# EAGLE board CrowPanel Pico Display-2.8_V1.0_240412 (EAGLE 9.6.2)
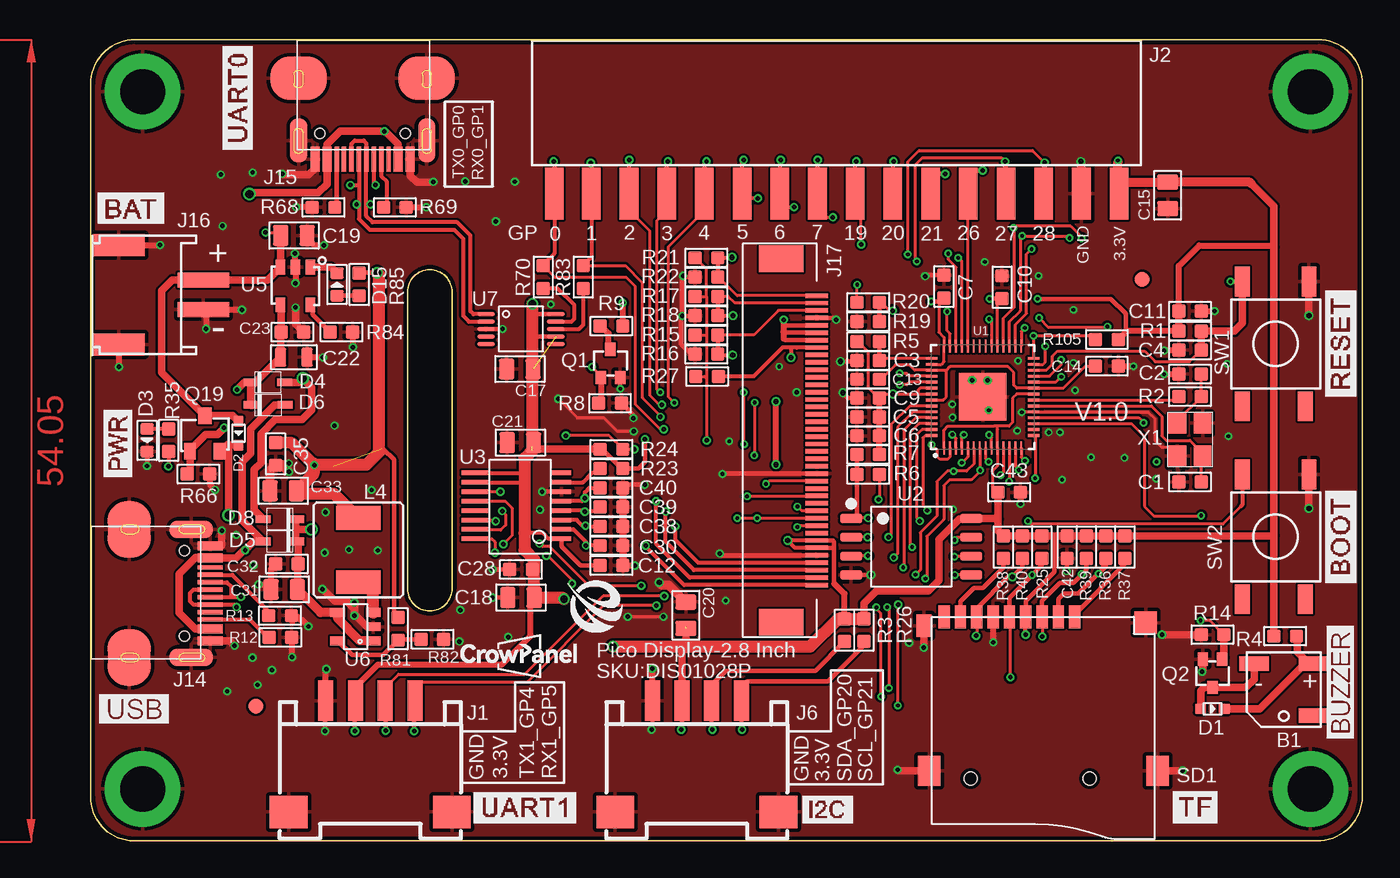
[diagram p5: board, top side]
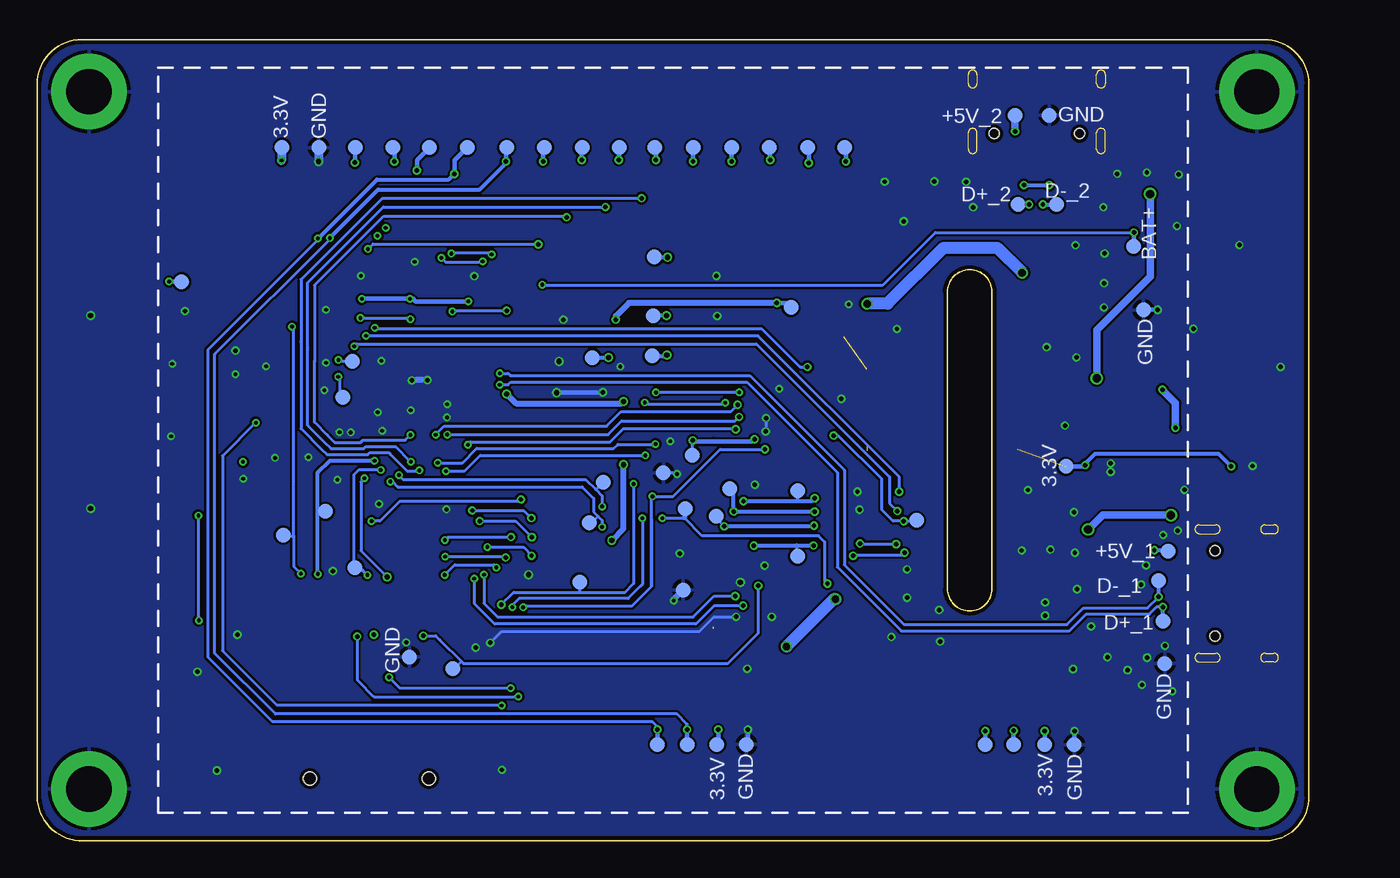
[diagram p6: board, bottom side, seen from below]

Size 85.7 x 54 mm. Coordinates in mm from the lower left corner, seen from the top.
Outline: 2.9,0 82.6,0 arc90 85.7,3 85.7,51 arc90 82.7,54 3,54 arc90 0,51 0,3 arc90 2.9,0
Outline: 21.35,37 21.35,17 arc180 24.35,17 24.35,37 arc180 21.35,37
Copper layers (1*16): Top 0.035mm / dielectric 1.5mm / Bottom 0.035mm
Design rules "default *": minimum track width 0.2mm, minimum drill 0.3mm, track to track 6mil, track to pad 6mil, pad to pad 6mil, via to via 6mil, smd to smd 6mil, copper to edge 10mil, drill to drill 6mil, minimum pad ring 5mil, minimum via ring 5mil, stop-mask expansion 4mil, vias tented up to drill 100mil, thermal gap 10mil
Net classes: 1 PWR: width 0.254 mm; 2 GND: width 0.203 mm; 3 RS485: width 0.203 mm, clearance 0.203 mm; 4 USB: width 0.203 mm, clearance 0.152 mm; 5 ANT: width 0.889 mm, clearance 0.203 mm

## Footprints (pad centres in the part's own frame; a part is rotated, then mirrored left to right if it is on the bottom)
BEEP_5025 = smd 2 x 1: 1 -2,-1.75; 2 2,-1.75; 3 -2,1.75
A_XBJ_0603 = smd 0.889 x 0.889: 1 -0.762,0; 2 0.762,0
A_XBJ_0805 = smd 1.016 x 1.397: 1 -0.889,0; 2 0.889,0
0805_S = smd 0.762 x 1.27: 1 -0.889,0; 2 0.889,0
C0603 = smd 0.889 x 0.889: 1 -0.762,0; 2 0.762,0
DISCRETE_C0603 = smd 0.889 x 0.889: 1 -0.762,0; 2 0.762,0
0603 = smd 0.889 x 0.889: 1 -0.762,0; 2 0.762,0
SOD-523 = smd 0.762 x 0.7: + -0.8,0; - 0.8,0
DISCRETE_D0603 = smd 0.762 x 0.889: + -0.762,0; - 0.762,0
SOD-323 = smd 1.016 x 0.508: 1 1.137,0; 2 -1.137,0
CONNECTOR_4P-SMD-2.0-90D = smd 1.01 x 2.74: 1 -3,-0.1; 2 -1,-0.1; 3 1,-0.1; 4 3,-0.1 | smd 2.54 x 2.184: SS1 -5.5,7.4; SS2 5.5,7.4
2.54-16P-WOTIE = smd 1.25 x 3.5: 1 -18.999,-5.572; 2 -16.51,-5.572; 3 -13.97,-5.572; 4 -11.43,-5.572; 5 -8.89,-5.572; 6 -6.35,-5.572; 7 -3.81,-5.572; 8 -1.27,-5.572; 9 1.27,-5.572; 10 3.81,-5.572; 11 6.35,-5.572; 12 8.89,-5.572; 13 11.43,-5.572; 14 13.97,-5.572; 15 16.51,-5.572; 16 19.05,-5.572
KEVIN_3.0TYPEC-SMD = smd 0.3 x 1.7: A1 -3.35,0.5; A4 -2.55,0.5; A5 -1.25,0.5; A6 -0.25,0.5; A7 0.25,0.5; A8 1.25,0.5; A9 2.55,0.5; A12 3.35,0.5; B1 3.05,0.5; B4 2.25,0.5; B5 1.75,0.5; B6 0.75,0.5; B7 -0.75,0.5; B8 -1.75,0.5; B9 -2.25,0.5; B12 -3.05,0.5 | smd 1.143 x 2.921: P$6 -4.318,-0.762; P$7 4.318,-0.762 | smd 3.81 x 2.921: P$8 -4.318,-4.953; P$9 4.318,-4.953 | hole 0.68: -2.89,-1.22; 2.89,-1.22
PH2.0WT-2PIN = smd 1 x 3.5: P$1 -1,0; P$2 1,0 | smd 1.5 x 3.5: P$3 -3.35,-5.7; P$4 3.35,-5.7
40PIN-0.5MM = smd 0.3 x 1.5: 1 9.42,1.73; 2 8.92,1.73; 3 8.42,1.73; 4 7.92,1.73; 5 7.42,1.73; 6 6.92,1.73; 7 6.42,1.73; 8 5.92,1.73; 9 5.42,1.73; 10 4.92,1.73; 11 4.42,1.73; 12 3.92,1.73; 13 3.42,1.73; 14 2.92,1.73; 15 2.42,1.73; 16 1.92,1.73; 17 1.42,1.73; 18 0.92,1.73; 19 0.42,1.73; 20 -0.08,1.73; 21 -0.58,1.73; 22 -1.08,1.73; 23 -1.58,1.73; 24 -2.08,1.73; 25 -2.58,1.73; 26 -3.08,1.73; 27 -3.58,1.73; 28 -4.08,1.73; 29 -4.58,1.73; 30 -5.08,1.73; 31 -5.58,1.73; 32 -6.08,1.73; 33 -6.58,1.73; 34 -7.08,1.73; 35 -7.58,1.73; 36 -8.08,1.73; 37 -8.58,1.73; 38 -9.08,1.73; 39 -9.58,1.73; 40 -10.08,1.73 | smd 1.8 x 3: P$41 -12.58,-0.67; P$42 11.92,-0.67
CD54_CD54 = smd 3 x 1.6: 1 0,2.159; 2 0,-2.159
CROWPI_POW_PAD-1.0MM = smd 1 x 1: P$1 0,0
PAD-1.0MM = smd 1 x 1: P$1 0,0
SOT-323_W = smd 0.7 x 0.9: 1 -0.65,-0.95; 2 0.65,-0.95; 3 0,0.95
SOT-23 = smd 1.1 x 0.8: 1 1.2,-1; 2 1.2,1 | smd 1.1 x 0.9: 3 -1.2,0
DISCRETE_R0603 = smd 0.889 x 0.889: 1 -0.762,0; 2 0.762,0
9P-SMD-W/-RING = smd 1.524 x 0.762: 1 0,4.4; 2 0,3.3; 3 0,2.2; 4 0,1.1; 5 0,0; 6 0,-1.1; 7 0,-2.2; 8 0,-3.3; 9 0,-4.4 | smd 1.524 x 1.016: G1 0.6,-5.746 | smd 2.032 x 1.524: G2 10.373,-5.4; G3 10.373,10 | smd 1.524 x 1.524: G4 0.392,9.181 | hole 0.889: 10.9,-2.6; 10.9,5.4
KEY-6 = smd 2 x 1: 1 -4.2,2.25; 2 -4.2,-2.25; 3 4.2,-2.25; 4 4.2,2
3M-5 = drill 3.048 pad 5.08: 1 0,0
RP2040_QFN-56 = smd 0.875 x 0.2: 1 -3.437,2.6; 2 -3.437,2.2; 3 -3.437,1.8; 4 -3.437,1.4; 5 -3.437,1; 6 -3.437,0.6; 7 -3.437,0.2; 8 -3.437,-0.2; 9 -3.437,-0.6; 10 -3.437,-1; 11 -3.437,-1.4; 12 -3.437,-1.8; 13 -3.437,-2.2; 14 -3.437,-2.6; 29 3.437,-2.6; 30 3.437,-2.2; 31 3.437,-1.8; 32 3.437,-1.4; 33 3.437,-1; 34 3.437,-0.6; 35 3.437,-0.2; 36 3.437,0.2; 37 3.437,0.6; 38 3.437,1; 39 3.437,1.4; 40 3.437,1.8; 41 3.437,2.2; 42 3.437,2.6 | smd 0.2 x 0.875: 15 -2.6,-3.437; 16 -2.2,-3.437; 17 -1.8,-3.437; 18 -1.4,-3.437; 19 -1,-3.437; 20 -0.6,-3.437; 21 -0.2,-3.437; 22 0.2,-3.437; 23 0.6,-3.437; 24 1,-3.437; 25 1.4,-3.437; 26 1.8,-3.437; 27 2.2,-3.437; 28 2.6,-3.437; 43 2.6,3.437; 44 2.2,3.437; 45 1.8,3.437; 46 1.4,3.437; 47 1,3.437; 48 0.6,3.437; 49 0.2,3.437; 50 -0.2,3.437; 51 -0.6,3.437; 52 -1,3.437; 53 -1.4,3.437; 54 -1.8,3.437; 55 -2.2,3.437; 56 -2.6,3.437 | smd 3.2 x 3.2: EPAD 0,0
SELF_SOIC-8-208MIL = smd 1.5 x 0.635: 1 -4.05,1.905; 2 -4.05,0.635; 3 -4.05,-0.635; 4 -4.05,-1.905; 5 4.05,-1.905; 6 4.05,-0.635; 7 4.05,0.635; 8 4.05,1.905
XP2046-SSOP16 = smd 0.305 x 1.27: 1 -2.54,-2.54; 2 -1.905,-2.54; 3 -1.27,-2.54; 4 -0.635,-2.54; 5 0,-2.54; 6 0.635,-2.54; 7 1.27,-2.54; 8 1.905,-2.54 | smd 0.305 x 1.778: 9 1.905,3.302; 10 1.27,3.302; 11 0.635,3.302; 12 0,3.302; 13 -0.635,3.302; 14 -1.27,3.302; 15 -1.905,3.302; 16 -2.54,3.302
SOP23-5 = smd 1 x 0.635: 1 -1.27,1; 2 -1.27,0; 3 -1.27,-1; 4 1.27,-1; 5 1.27,1
CROWBOT_-V1.0-20220525_A_XBJ_SOT23-5 = smd 0.6 x 1: 1 -0.95,-1.2; 2 0,-1.2; 3 0.95,-1.2; 4 0.95,1.2; 5 -0.95,1.2
MSOP-10_W = smd 1.2 x 0.3: 1 -2.35,1; 2 -2.35,0.5; 3 -2.35,0; 4 -2.35,-0.5; 5 -2.35,-1; 6 2.35,-1; 7 2.35,-0.5; 8 2.35,0; 9 2.35,0.5; 10 2.35,1
A_XBJ_SMD3225 = smd 1.4 x 1.2: 1 -1.1,-0.85; 2 1.1,-0.85; 3 1.1,0.85; 4 -1.1,0.85

## Placement (x,y rotation side)
B1  BEEP_5025  [BEEP_5025]  80.4,10.2 180 top
C1  12PF  [A_XBJ_0603]  74.08,24.2 180 top
C2  12PF  [A_XBJ_0603]  74.08,31.46 0 top
C3  2.2UF  [A_XBJ_0603]  52.4,32.38 180 top
C4  100NF  [A_XBJ_0603]  74.08,33.08 180 top
C5  100NF  [A_XBJ_0603]  52.4,28.58 180 top
C6  2.2UF  [A_XBJ_0603]  52.4,27.31 180 top
C7  100NF  [A_XBJ_0603]  57.5,37.36 90 top
C9  100NF  [A_XBJ_0603]  52.4,29.86 180 top
C10  100NF  [A_XBJ_0603]  61.42,37.32 90 top
C11  100NF  [A_XBJ_0603]  74.08,35.7 0 top
C12  100NF  [A_XBJ_0603]  35.1,18.56 0 top
C13  100NF  [A_XBJ_0603]  52.4,31.11 180 top
C14  100NF  [A_XBJ_0603]  68.48,32 0 top
C15  47UF  [A_XBJ_0805]  72.57,43.51 90 top
C17  47UF  [A_XBJ_0805]  28.93,31.8 180 top
C18  22UF  [A_XBJ_0805]  29,16.4 0 top
C19  22UF  [A_XBJ_0805]  13.7,40.8 180 top
C20  47UF  [A_XBJ_0805]  40.11,15.21 90 top
C21  47UF  [A_XBJ_0805]  28.96,26.85 180 top
C22  22uF  [0805_S]  13.69,32.6 180 top
C23  100nF  [C0603]  13.59,34.3 0 top
C28  1uF  [DISCRETE_C0603]  29,18.3 0 top
C30  100pF  [0603]  35.1,19.9 180 top
C31  22UF  [A_XBJ_0805]  13.04,16.95 0 top
C32  100nF  [A_XBJ_0603]  13.23,18.66 180 top
C33  22UF  [A_XBJ_0805]  12.98,23.59 0 top
C35  100NF  [A_XBJ_0603]  12.47,26.08 270 top
C38  100pF  [0603]  35.1,21.2 180 top
C39  100pF  [0603]  35.1,22.5 180 top
C40  100pF  [0603]  35.1,23.8 180 top
C42  1uF  [DISCRETE_C0603]  65.8,19.8 90 top
C43  100nF  [C0603]  61.9,23.5 0 top
D1  B5819WT  [SOD-523]  75.6,8.9 0 top
D2  B5819WT  [SOD-523]  9.96,27.47 270 top
D3  [DISCRETE_D0603]  3.8,27 270 top
D4  SOD-323  [SOD-323]  11.94,30.91 0 top
D5  SOD-323  [SOD-323]  12.76,20.18 180 top
D6  SOD-323  [SOD-323]  11.96,29.39 0 top
D8  SOD-323  [SOD-323]  12.76,21.69 180 top
D15  NC  [DISCRETE_D0603]  16.6,37.5 90 top
J1  [CONNECTOR_4P-SMD-2.0-90D]  18.85,9.35 180 top
J2  2.54-16PIN-WOTIE  [2.54-16P-WOTIE]  50.25,49.2 0 top
J6  [CONNECTOR_4P-SMD-2.0-90D]  40.85,9.35 180 top
J14  USB_TYPE-C_16PIN3.0USB  [KEVIN_3.0TYPEC-SMD]  7.55,16.68 270 top
J15  USB_TYPE-C_16PIN3.0USB  [KEVIN_3.0TYPEC-SMD]  18.33,46.45 180 top
J16  PH2.0WT-2PIN  [PH2.0WT-2PIN]  7.6,36.8 270 top
J17  LXGD-28A1044-E-T2  [40PIN-0.5MM]  47.2,26.67 270 top
L4  5.6uH-0530  [CD54_CD54]  18.04,19.6 180 top
P1  CROWPI_POW_PADPAD-1.0MM  [CROWPI_POW_PAD-1.0MM]  9.71,11.95 0 bottom
P2  CROWPI_POW_PADPAD-1.0MM  [CROWPI_POW_PAD-1.0MM]  9.47,19.52 0 bottom
P3  CROWPI_POW_PADPAD-1.0MM  [CROWPI_POW_PAD-1.0MM]  9.83,14.8 0 bottom
P4  CROWPI_POW_PADPAD-1.0MM  [CROWPI_POW_PAD-1.0MM]  10.14,17.55 0 bottom
P5  CROWPI_POW_PADPAD-1.0MM  [CROWPI_POW_PAD-1.0MM]  49.14,17.44 0 bottom
P6  CROWPI_POW_PADPAD-1.0MM  [CROWPI_POW_PAD-1.0MM]  11.14,35.79 0 bottom
P7  CROWPI_POW_PADPAD-1.0MM  [CROWPI_POW_PAD-1.0MM]  11.81,40.06 0 bottom
P8  CROWPI_POW_PADPAD-1.0MM  [CROWPI_POW_PAD-1.0MM]  31.28,46.73 0 bottom
P9  CROWPI_POW_PADPAD-1.0MM  [CROWPI_POW_PAD-1.0MM]  60.6,12.39 0 bottom
P10  CROWPI_POW_PADPAD-1.0MM  [CROWPI_POW_PAD-1.0MM]  17.8,6.5 0 bottom
P11  CROWPI_POW_PADPAD-1.0MM  [CROWPI_POW_PAD-1.0MM]  65.1,29.9 0 bottom
P12  CROWPI_POW_PADPAD-1.0MM  [CROWPI_POW_PAD-1.0MM]  64.46,32.33 0 bottom
P13  CROWPI_POW_PADPAD-1.0MM  [CROWPI_POW_PAD-1.0MM]  41.55,26.01 0 bottom
P14  CROWPI_POW_PADPAD-1.0MM  [CROWPI_POW_PAD-1.0MM]  15.81,6.48 0 bottom
P15  CROWPI_POW_PADPAD-1.0MM  [CROWPI_POW_PAD-1.0MM]  41.9,6.5 0 bottom
P16  CROWPI_POW_PADPAD-1.0MM  [CROWPI_POW_PAD-1.0MM]  43.9,6.5 0 bottom
P17  CROWPI_POW_PADPAD-1.0MM  [CROWPI_POW_PAD-1.0MM]  33.78,46.73 0 bottom
P18  CROWPI_POW_PADPAD-1.0MM  [CROWPI_POW_PAD-1.0MM]  36.38,46.73 0 bottom
P19  CROWPI_POW_PADPAD-1.0MM  [CROWPI_POW_PAD-1.0MM]  38.88,46.73 0 bottom
P20  CROWPI_POW_PADPAD-1.0MM  [CROWPI_POW_PAD-1.0MM]  41.47,46.73 0 bottom
P21  CROWPI_POW_PADPAD-1.0MM  [CROWPI_POW_PAD-1.0MM]  37.9,6.5 0 bottom
P22  CROWPI_POW_PADPAD-1.0MM  [CROWPI_POW_PAD-1.0MM]  39.9,6.5 0 bottom
P23  CROWPI_POW_PADPAD-1.0MM  [CROWPI_POW_PAD-1.0MM]  19.9,6.5 0 bottom
P24  CROWPI_POW_PADPAD-1.0MM  [CROWPI_POW_PAD-1.0MM]  21.8,6.5 0 bottom
P25  CROWPI_POW_PADPAD-1.0MM  [CROWPI_POW_PAD-1.0MM]  17.5,48.9 0 bottom
P26  CROWPI_POW_PADPAD-1.0MM  [CROWPI_POW_PAD-1.0MM]  19.8,48.9 0 bottom
P27  CROWPI_POW_PADPAD-1.0MM  [CROWPI_POW_PAD-1.0MM]  19.6,42.9 0 bottom
P28  CROWPI_POW_PADPAD-1.0MM  [CROWPI_POW_PAD-1.0MM]  17,42.9 0 bottom
P29  CROWPI_POW_PADPAD-1.0MM  [CROWPI_POW_PAD-1.0MM]  42.16,16.91 0 bottom
P30  CROWPI_POW_PADPAD-1.0MM  [CROWPI_POW_PAD-1.0MM]  69.2,46.74 0 bottom
P31  CROWPI_POW_PADPAD-1.0MM  [CROWPI_POW_PAD-1.0MM]  75.96,37.68 0 bottom
P32  CROWPI_POW_PADPAD-1.0MM  [CROWPI_POW_PAD-1.0MM]  42.02,22.4 0 bottom
P33  CROWPI_POW_PADPAD-1.0MM  [CROWPI_POW_PAD-1.0MM]  34.46,19.18 0 bottom
P34  CROWPI_POW_PADPAD-1.0MM  [CROWPI_POW_PAD-1.0MM]  47.54,24.19 0 bottom
P35  CROWPI_POW_PADPAD-1.0MM  [CROWPI_POW_PAD-1.0MM]  48.49,21.44 0 bottom
P36  CROWPI_POW_PADPAD-1.0MM  [CROWPI_POW_PAD-1.0MM]  66.26,22.21 0 bottom
P37  CROWPI_POW_PADPAD-1.0MM  [CROWPI_POW_PAD-1.0MM]  34.46,23.59 0 bottom
P38  CROWPI_POW_PADPAD-1.0MM  [CROWPI_POW_PAD-1.0MM]  39.04,23.74 0 bottom
P39  CROWPI_POW_PADPAD-1.0MM  [CROWPI_POW_PAD-1.0MM]  39.95,21.89 0 bottom
P41  CROWPI_POW_PADPAD-1.0MM  [CROWPI_POW_PAD-1.0MM]  34.89,35.95 0 bottom
P42  CROWPI_POW_PADPAD-1.0MM  [CROWPI_POW_PAD-1.0MM]  43.5,24.8 0 bottom
P43  CROWPI_POW_PADPAD-1.0MM  [CROWPI_POW_PAD-1.0MM]  16.37,25.25 0 bottom
P44  CROWPI_POW_PADPAD-1.0MM  [CROWPI_POW_PAD-1.0MM]  26.44,21.6 0 bottom
P45  CROWPI_POW_PADPAD-1.0MM  [CROWPI_POW_PAD-1.0MM]  64.28,18.43 0 bottom
P46  CROWPI_POW_PADPAD-1.0MM  [CROWPI_POW_PAD-1.0MM]  57.7,11.6 0 bottom
P47  CROWPI_POW_PADPAD-1.0MM  [CROWPI_POW_PAD-1.0MM]  69.11,20.61 0 bottom
P48  PADPAD-1.0MM  [PAD-1.0MM]  11.14,9.08 0 top
P49  PADPAD-1.0MM  [PAD-1.0MM]  70.86,37.85 0 top
P50  CROWPI_POW_PADPAD-1.0MM  [CROWPI_POW_PAD-1.0MM]  44.07,46.73 0 bottom
P51  CROWPI_POW_PADPAD-1.0MM  [CROWPI_POW_PAD-1.0MM]  46.47,46.73 0 bottom
P52  CROWPI_POW_PADPAD-1.0MM  [CROWPI_POW_PAD-1.0MM]  48.97,46.73 0 bottom
P53  CROWPI_POW_PADPAD-1.0MM  [CROWPI_POW_PAD-1.0MM]  51.52,46.73 0 bottom
P54  CROWPI_POW_PADPAD-1.0MM  [CROWPI_POW_PAD-1.0MM]  54.06,46.73 0 bottom
P55  CROWPI_POW_PADPAD-1.0MM  [CROWPI_POW_PAD-1.0MM]  56.72,46.73 0 bottom
P56  CROWPI_POW_PADPAD-1.0MM  [CROWPI_POW_PAD-1.0MM]  59.26,46.73 0 bottom
P57  CROWPI_POW_PADPAD-1.0MM  [CROWPI_POW_PAD-1.0MM]  61.72,46.73 0 bottom
P58  CROWPI_POW_PADPAD-1.0MM  [CROWPI_POW_PAD-1.0MM]  64.26,46.73 0 bottom
P59  CROWPI_POW_PADPAD-1.0MM  [CROWPI_POW_PAD-1.0MM]  66.72,46.73 0 bottom
P60  CROWPI_POW_PADPAD-1.0MM  [CROWPI_POW_PAD-1.0MM]  44.25,32.69 0 bottom
P61  CROWPI_POW_PADPAD-1.0MM  [CROWPI_POW_PAD-1.0MM]  44.18,35.39 0 bottom
P62  CROWPI_POW_PADPAD-1.0MM  [CROWPI_POW_PAD-1.0MM]  44.1,39.36 0 bottom
P63  CROWPI_POW_PADPAD-1.0MM  [CROWPI_POW_PAD-1.0MM]  48.28,32.58 0 bottom
Q1  HXY2102EI  [SOT-323_W]  35.03,32.18 0 top
Q2  HXY2102EI  [SOT-323_W]  75.6,11.3 180 top
Q19  PMOS-3401-4A  [SOT-23]  7.69,27.46 270 top
R1  10K  [DISCRETE_R0603]  74.08,34.36 180 top
R2  1K  [DISCRETE_R0603]  74.08,29.94 180 top
R3  4.7K  [DISCRETE_R0603]  50.8,14.2 90 top
R4  3R  [DISCRETE_R0603]  80.5,13.8 180 top
R5  0R  [DISCRETE_R0603]  52.4,33.66 180 top
R6  1K  [DISCRETE_R0603]  52.4,24.7 0 top
R7  10K  [DISCRETE_R0603]  52.4,26.05 0 top
R8  10K/NC  [DISCRETE_R0603]  35,29.5 180 top
R9  0R 5%  [DISCRETE_R0603]  35.1,34.7 0 top
R12  5.1K  [DISCRETE_R0603]  12.79,13.73 0 top
R13  5.1K  [DISCRETE_R0603]  12.76,15.18 180 top
R14  10K/NC  [DISCRETE_R0603]  75.6,13.9 0 top
R15  NC  [DISCRETE_R0603]  41.5,34.1 180 top
R16  0R  [DISCRETE_R0603]  41.5,32.8 0 top
R17  10K  [DISCRETE_R0603]  41.5,36.7 180 top
R18  NC  [DISCRETE_R0603]  41.5,35.4 0 top
R19  100K1%  [DISCRETE_R0603]  52.4,35 180 top
R20  100K1%  [DISCRETE_R0603]  52.4,36.3 0 top
R21  10K  [DISCRETE_R0603]  41.5,39.3 180 top
R22  NC  [DISCRETE_R0603]  41.5,38 0 top
R23  10K/NC  [DISCRETE_R0603]  35.1,25.1 180 top
R24  1K  [DISCRETE_R0603]  35.1,26.4 180 top
R25  1K  [DISCRETE_R0603]  64.1,19.8 90 top
R26  4.7K  [DISCRETE_R0603]  52.1,14.2 90 top
R27  3R  [DISCRETE_R0603]  41.54,31.3 180 top
R35  4.7K  [DISCRETE_R0603]  5.25,27 270 top
R36  10K  [DISCRETE_R0603]  68.4,19.8 270 top
R37  10K  [DISCRETE_R0603]  69.7,19.8 270 top
R38  10K  [DISCRETE_R0603]  61.5,19.8 270 top
R39  10K  [DISCRETE_R0603]  67.1,19.8 270 top
R40  10K  [DISCRETE_R0603]  62.8,19.8 270 top
R66  10K  [DISCRETE_R0603]  7.26,24.72 180 top
R68  5.1K  [DISCRETE_R0603]  15.7,42.7 180 top
R69  5.1K  [DISCRETE_R0603]  20.5,42.7 180 top
R70  0R  [DISCRETE_R0603]  30.5,38 90 top
R81  45.3K 1%  [DISCRETE_R0603]  20.71,14.29 270 top
R82  10K 1%  [DISCRETE_R0603]  23.03,13.59 180 top
R83  0R  [DISCRETE_R0603]  33.2,38 90 top
R84  2K  [DISCRETE_R0603]  16.9,34.3 0 top
R85  4.7K  [DISCRETE_R0603]  18.1,37.5 90 top
R105  10K  [DISCRETE_R0603]  68.48,33.8 0 top
SD1  [9P-SMD-W/-RING]  61.91,15.1 270 top
SW1  KEY-6  [KEY-6]  79.85,33.5 270 top
SW2  KEY-6  [KEY-6]  79.85,20.5 270 top
T1  3M-5  [3M-5]  3.5,50.5 0 top
T2  3M-5  [3M-5]  3.5,3.5 0 top
T3  3M-5  [3M-5]  82.2,3.5 0 top
T4  3M-5  [3M-5]  82.2,50.5 0 top
U1  RP2040_RP2040  [RP2040_QFN-56]  60.11,29.92 90 top
U2  SELF_W25Q128JV  [SELF_SOIC-8-208MIL]  55.3,19.83 0 top
U3  XPT2046  [XP2046-SSOP16]  29.2,22.9 90 top
U5  4054A  [SOP23-5]  13.8,37.4 270 top
U6  HM3416H  [CROWBOT_-V1.0-20220525_A_XBJ_SOT23-5]  17.85,14.44 90 top
U7  CH340X  [MSOP-10_W]  29,34.5 0 top
X1  12MHZ_SMD3225  [A_XBJ_SMD3225]  74.08,27.05 90 top

## Tracks (layer width: path | path; a pad name or v marks a point on that pad's centre or on a via)
+1V1
  Top 0.2: 54.22,32.08 53.25,31.11 C13.1 | U1.50 57.46,29.72 57.66,29.92 57.66,31.7 | U1.23 62.41,30.52 62.21,30.72 62.21,31.56 61.81,31.95 57.91,31.95 57.66,31.7 | 57.66,31.7 57.64,31.72 U1.45
  Top 0.203: U1.45 55.52,31.72 55.16,32.08 54.22,32.08 | U1.23 65.55,30.52 67.03,32 C14.1
+3V3  (via drill 0.25, 0.3, 0.35, 0.5)  (4 unrouted)
  Top 0.2: U1.44 57.32,32.12 57.51,32.31 U1.42 | 58.97,21.69 59.3,21.69 U2.8 | U1.1 57.51,27.71 57.75,27.95 60.87,27.95 60.9,27.95 | U1.10 61.11,27.74
  Top 0.203: 53.3,29.86 C9.1 | 69.22,45.76 v69.22,45.86 | R7.2 53.31,26.05 | C9.1 53.42,30.12 v54.06,30.12 55.78,30.12 | 55.78,30.12 U1.49 | 55.78,30.12 55.78,30.41 55.89,30.52 U1.48 | R21.2 41.49,38.55 41.49,36.69 | R17.2 41.48,36.7 41.49,36.69 | U1.33 61.11,36.25 C10.1 | U1.42 57.51,33.94 57.16,34.29 57.16,36.36 57.16,36.9 57.46,36.6 C7.1 | U1.22 62.41,30.12 62.13,29.84 62.13,28.2 61.88,27.95 61.11,27.95 | 61.11,27.95 60.87,27.95 | 61.11,27.74 61.11,27.95 | U1.10 61.11,25.28 60.75,24.92 60.75,23.89 C43.1 | C9.1 53.07,29.86 52.41,30.53 52.41,32.95 51.7,33.66 | v41.52,26.99 41.49,27.02 41.49,31.15 | 41.49,36.69 41.49,34.08 | 41.49,34.08 41.49,31.15 | R15.2 41.47,34.1 41.49,34.08 | 69.8,34.36 R105.2 | J2.16 69.3,43.95 69.66,44.31 | R27.2 41.34,31.3 41.49,31.15
  Top 0.254: v63,13.9 SD1.4 | 61.31,20.37 R38.1 | R35.2 5.25,25.24 v5.23,25.24 | 15.03,25.45 13.63,26.84 C35.1 13.39,26.84 14.87,25.33 v15.07,25.33 | J17.7 v46.98,20.25 | v46.98,20.25 v46.97,20.25 | J17.6 47.48,19.75 v46.98,20.25 | U3.9 29.22,24.8 29.23,24.82 | U3.10 29.18,24.17 29.23,24.12 | U3.1 30.86,20.36 30.48,20.74 29.23,20.74
  Top 0.3: J6.3 39.85,7.55 v39.8,7.5
  Top 0.305: 64.1,20.46 R25.2 | 73.31,35.69 C11.1 | C12.1 33.01,18.56 31.74,19.83 U3.1 | U7.7 29.76,34 29.76,35.53 | 51.7,33.66 R5.2 | R24.2 34.46,26.4 35.76,25.1 R23.1 36.91,25.1 37.35,25.54 v37.35,27.07 | v41.52,26.99 41.59,26.92 | R85.2 18.13,38.29 v19.31,38.29 | v29.77,36.2 v29.76,36.19 29.76,35.53 | U7.10 29.79,35.5 29.76,35.53 | v17.8,7.4 17.8,9.4 J1.3 | SD1.4 63.01,16.19 64.95,18.13 64.95,20.5 64.89,20.56 | J17.7 50.01,20.25 50.1,20.16 50.1,19.75 | 50.1,17.35 50.1,19.75 | J17.6 50.1,19.75 | C10.1 60.61,36.56 v60.59,36.54 | v63.82,36.53 68.76,36.53 69.75,35.54 69.75,34.31 | v56.65,36.36 57.16,36.36 | R81.1 20.44,15.32 20.44,25.69 19.72,26.41 19.64,26.41 | 29.88,16.17 29.66,16.17
  Top 0.406: 53.3,29.86 53.16,29.72 C5.1 C6.1 R7.2 | R105.2 69.75,34.31 | R1.2 69.8,34.36 | R3.2 50.8,16.65 50.1,17.35 | C11.1 73.32,38.75 74.7,40.13 79.64,40.13 79.74,40.03 | J1.3 17.85,10.37 19.37,11.89 27.72,11.89 29.66,13.82 29.66,16.17 29.75,16.26 | v46.18,25.36 v46.18,29.61
  Top 0.508: C18.2 | C18.2 29.75,16.26 | C18.2 29.88,16.17 | 29.89,18.17 C28.2 | 29.76,26.58 29.76,26.4 R24.2 | 40.13,13.07 39.85,12.79 J6.3 | R37.1 69.88,20.74 | R105.2 69.33,33.89 | v31.9,16.3 29.97,16.3 C18.2 | R4.2 79.74,20.56 | R37.1 R36.1 R39.1 C42.2 64.89,20.56 64.2,20.56 64.1,20.46 | R25.2 R40.1 R38.1 61.14,20.92 61.14,21.67 | 61.14,21.67 C43.1 | U2.8 61.07,21.73 61.14,21.67 | R1.2 73.32,35.68 73.31,35.69 | R26.2 52.1,15.99 52.95,16.84 56.45,16.84 57.15,17.54 57.15,20.31 58.53,21.69 58.97,21.69 | 40.13,13.07 40.13,14.41 | 40.13,13.07 48.46,13.07 50.35,14.96 R3.2 | R37.1 79.74,20.56 | 79.74,20.56 79.74,40.03 79.74,42.78 78.21,44.31 | 69.66,44.31 69.59,44.38
  Top 0.61: 69.22,45.76 69.22,43.71 J2.16 69.3,44.32 69.38,44.4 C15.2 78.12,44.4 78.21,44.31
  Top 0.813: L4.2 16.41,23.39 14.07,23.39 C33.2 15.03,24.75 15.03,25.45 | C35.1 13.57,26.81 15.02,25.37 15.15,25.37 18.59,25.37 19.45,26.22 19.45,38.16 v19.31,38.29 | v29.77,36.2 29.77,26.81 29.81,26.81 C21.1 29.76,26.76 29.76,26.4 | v31.9,16.3 31.8,16.4 C18.2 29.89,18.17 29.89,18.95 29.23,19.6 29.23,20.74 29.23,24.12 29.23,24.82 29.23,25.78 29.76,26.31 | v35.2,13.1 40.1,13.1 | 40.1,13.1 40.13,13.07 | 40.1,13.1 48.49,13.1 50.35,14.96 | 52.11,14.96 R26.2 R3.2 | 29.76,31.75 C17.1
  Bottom 0.203: P13.P$1 41.55,26.92 40.1,26.92
  Bottom 0.254: v5.23,25.24 6.08,26.09 14.41,26.09 15.25,25.25 P43.P$1
  Bottom 0.3: v39.8,7.5 39.8,6.6 P22.P$1
  Bottom 0.305: v37.35,27.07 37.5,26.92 40.1,26.92 41.45,26.92 v41.52,26.99 | P10.P$1 v17.8,7.4 | P43.P$1 15.15,25.25 v15.07,25.33 | v63.82,36.53 v63.81,36.54 v60.59,36.54 60.37,36.54 60.19,36.36 v56.65,36.36
  Bottom 0.406: v46.97,20.25 46.18,21.05 v46.18,25.36 | v46.18,29.61 46.31,29.48 53.41,29.48 54.06,30.13 v54.06,30.12
  Bottom 0.61: P30.P$1 69.22,46.72 v69.22,45.86
  Bottom 0.813: v19.31,38.29 20.99,39.97 24.62,39.97 28.39,36.2 v29.77,36.2 | v31.9,16.3 32,16.3 v35.2,13.1
+5V_UART0  (via drill 0.3, 0.55)
  Top 0.254: 20.73,46.1 J15.A4 J15.B9 | J15.B4 J15.A9 | J15.B4 15.92,45.79 | J15.B4 15.93,46.1 15.93,46.48
  Top 0.508: 20.73,46.1 20.73,46.95 19.86,47.83 v19.79,47.83 16.81,47.83 15.93,46.94 15.93,46.48 15.93,45.95 | 15.92,45.79 15.92,44.27 15.34,43.69 10.79,43.69 v10.7,43.6 | D4.1 14.02,30.91 v14.3,31.18 14.9,30.57 14.9,29.05 14.24,28.39 12.44,28.39 11.48,27.42 11.48,25.48 11.02,25.03 11.02,22.27 11.04,22.27 D8.1 11.64,21.67 11.85,21.67
  Bottom 0.508: P26.P$1 v19.8,47.84 v19.79,47.83 | v10.7,43.6 10.69,43.59 10.69,38.02 14.3,34.41 v14.3,31.18
+5V_USB  (via drill 0.3)
  Top 0.254: 8.21,19.07 J14.A4 J14.B9 7.91,19.07 7.91,19.09 | 8.05,14.29 J14.B4 J14.A9
  Top 0.508: 8.21,19.07 9.82,19.07 10.38,19.63 v10.41,19.6 11,20.18 D5.1 10.22,21.59 10.22,25.55 10.77,26.1 10.77,27.76 12.4,29.39 D6.1 | 8.05,14.29 7.03,14.29 5.97,15.36 5.97,17.99 7.07,19.09 7.91,19.09
  Bottom 0.254: v10.41,19.6 9.55,19.6 P2.P$1
AVDD
  Top 0.2: U1.43 53.3,32.52 C3.1
  Top 0.203: 53.5,32.52 C3.1
  Top 0.305: C3.1 R5.1
BAT+  (via drill 0.25, 0.3)
  Top 0.203: v11.79,41 12.61,41 C19.2 | R20.1 51.64,37.48 v51.65,37.49
  Top 0.508: C19.2 12.8,40.79 U5.3 11.93,37.8 J16.P$1 5.5,37.8 4.78,37.08 4.78,31.58 Q19.3 9.57,28.66 D2.+
  Bottom 0.203: v11.79,41 v11.8,41.01 25.18,41.01 28.75,37.44 51.6,37.44 v51.65,37.49
  Bottom 0.305: P7.P$1 v11.8,41.01
BOOT  (via drill 0.25, 0.3)
  Top 0.203: 77.6,24.2 77.6,24.6 SW2.2 | R6.2 53.16,23.08 v53.09,23.01 | v63.16,21.56 63.37,21.35 76.31,21.35 77.51,22.55
  Top 0.254: SW2.2 77.6,22.64 77.51,22.55
  Top 0.305: 77.6,24.45 77.6,24.6
  Bottom 0.203: v53.09,23.01 53.21,22.9 61.25,22.9 62.59,21.56 v63.16,21.56
CHG_LED
  Top 0.508: U5.1 16.19,38.67 D15.-
GND  (via drill 0.25, 0.3, 0.35)
  Top 0.203: J14.B12 8.22,19.9 | J14.A12 8.2,13.48 | v38.6,15.1 v36.2,15.1 | v36.6,27.6 35.5,27.6 34.6,28.5 32.8,28.5 v31.5,29.8 | J15.A12 15.15,45.78 | J15.A1 21.53,45.8 | X1.4 72.63,26.55 72.16,26.55 71.71,26.99 71.71,28.46 71.25,28.92 U1.19 62.77,28.92 v62.75,28.9
  Top 0.3: v50.24,35.13 50.12,35.25 J17.37 | J6.4 37.85,7.55 v37.8,7.5
  Top 0.305: U7.3 v27.76,34.5 | C28.1 v27.08,18.3 | C18.1 v27.09,16.4 v27.08,16.39 | U3.6 v30.43,23.54 v30.42,23.53 | J17.5 42.52,19.25 v42.4,19.37 | J17.16 42.6,24.75 v42.58,24.73 | Q1.2 v35.69,30.48 | R8.1 36.58,28.68 v36.58,28.5 | C40.1 36.07,24.01 v37.33,24.01 | v15.8,7.4 15.8,9.4 J1.4 | C42.1 65.8,18.22 v65.77,18.19 | C9.2 51.04,29.86 v50.7,30.21 | U2.4 52.56,17.93 v52.58,17.94 | C3.2 51.58,32.32 v50.53,32.32 | R18.1 40.72,35.38 v39.86,35.38 | R22.1 40.01,38 v39.92,38.09 39.86,38.03 v39.86,35.38 | C7.2 56.3,38.12 v56.24,38.06 | D3.- v3.8,25.28 v3.79,25.27 | R16.1 40.47,32.8 39.78,33.5 39.78,35.3 v39.86,35.38
  Top 0.406: v10.19,35.8 J16.P$2 7.78,35.62 v7.78,34.51 | J16.P$3 v4.67,40.15 v4.68,40.16 | J16.P$4 v1.9,31.95 v1.91,31.94 | R68.2 v13.86,42.7 v13.85,42.71 | C19.1 14.59,40.63 15.07,40.15 v15.73,40.15 | v13.77,39.59 13.77,38.7 U5.2 v13.8,37.59 | R69.1 21.27,42.71 v22.62,42.71 | 51.64,34.8 R19.2 | U2.4 51.31,17.87 | C22.1 15.64,32.6 v15.66,32.58 | R84.2 v17.66,33.29 v17.67,33.28 | C32.2 12.16,18.35 C31.1 11.83,17.28 v11.3,17.28 | R66.1 8.03,24.02 v8.39,23.66 | R13.1 13.32,15.18 13.58,14.92 | 13.58,14.78 13.58,14.92 | v14.68,14.46 14.21,14.93 14.09,14.93 13.61,15.41 13.61,14.89 13.58,14.92 | R12.2 13.55,12.41 v13.57,12.39 | U1.EPAD 60.11,30.36 v59.41,31.06 | C12.2 v36.67,18.56 v36.68,18.55 | SD1.6 60.81,13.4 v60.83,13.38 | J6.4 v37.85,11.6 | J1.4 15.85,11.55 v15.88,11.58 | C14.2 v70.26,32 v70.27,31.99 | C2.1 73.3,31.44 v72.33,31.44 | C4.2 73.28,33.04 v72.34,33.04 | C43.2 v62.66,22.71 | C11.2 v75.73,35.7 v75.74,35.71 | C35.2 13.23,25.32 v13.35,25.45 12.55,25.45 12.09,24.99 C33.1
  Top 0.508: C12.2 C30.1 C38.1 C39.1 C40.1 | 8.22,19.9 8.84,19.9 v8.84,20.92 | 8.2,13.48 9.37,13.48 v9.7,13.15 | C23.2 13.81,34.84 v13.81,35.95 | 15.15,45.78 15.15,45.34 14.7,44.89 12.99,44.89 v12.91,44.97 | 21.53,45.8 21.53,44.85 21.99,44.39 23.05,44.39 v23.09,44.43 | SD1.G1 56.16,13.04 v56.15,13.03 | SD1.G3 71.92,4.74 v73.58,4.74 | SD1.G2 54.43,4.73 v54.37,4.79 | SW1.1 v82.1,35.4 | SW2.1 v82.1,22.4 | 66.76,45.77 v66.74,45.79 | Q2.2 74.95,11.45 v74.9,11.4 | R14.1 v72.2,13.9 | v17.77,15.17 17.89,15.17 18.62,14.44 U6.2 | v15.62,16.97 15.64,16.97 16.45,16.16 17.25,16.16 17.77,15.64 v17.77,15.17 | v17.78,16.07 v17.78,15.18 v17.77,15.17
  Top 0.61: C33.1 12.09,24.99 C35.2 12.91,25.32 v13.36,24.87 | J2.15 66.76,45.77 | v38.32,17.42 38.5,17.23 38.96,17.23 C20.2
  Bottom 0.203: v38.6,15.1 40.07,15.1 41.08,14.09 54.42,14.09 v55.16,13.35 | v36.58,28.5 36.58,27.62 v36.6,27.6 | v42.58,24.73 42.65,24.8 P42.P$1
  Bottom 0.3: v37.8,7.5 37.8,6.6 P21.P$1
  Bottom 0.305: P14.P$1 v15.81,7.39 v15.8,7.4 | v50.7,30.21 47.61,30.21 v47.58,30.24 | v10.19,35.8 P6.P$1
  Bottom 0.406: v59.41,31.06 60.41,31.06 v60.44,31.03 | P29.P$1 42.8,16.27 v42.8,16.2
  Bottom 0.61: P59.P$1 66.74,46.71 v66.74,45.79
  other vias: 60.26,39.03 63.89,38.09 66.23,32.23 66.34,30.38 46.4,31.97 43.04,26.95 31.01,36.17 58.08,28.54 62.51,32.36 66.23,35.79 58.11,22.34 60.53,29.03 62.45,27.65 64.57,27.53 65.32,27.54 65.47,24.34 67.41,25.86 69.66,25.81 71.81,24.41 76.67,27.28 76.59,32.15 58.07,29.42 25.24,44.45 28.58,44.43 10.92,45.04 8.77,44.91 8.89,41.44 27.3,41.76 16.43,27.99 18.93,23.65 15.83,22.16 15.77,19.43 19.34,19.58 17.41,19.64 24.84,13.44 28.13,13.74 24.92,15.56 30.28,22.33 9.81,20.62 12.21,11.51 11.25,10.52 10.9,12.36 9.2,10.08 10.97,18.57
  pour Top: -1,55 -1,-1 86.5,-1 86.5,55
  pour Bottom: -0.5,54.5 -0.5,-0.5 86,-0.5 86,54.5
GND1  (via drill 0.25)
  other vias: 71.83,25.55
GP0/UART0_TX  (via drill 0.25, 0.3)
  Top 0.203: R70.2 31.26,38 36.09,38 36.7,37.39 36.7,29.46 38.42,27.74 v38.62,27.74 | U1.2 57.91,25.88 57.74,25.71 57.24,25.71 57.04,25.91 57.04,26.34 v56.68,26.7
  Top 0.254: R70.2 30.5,38.84 31.25,39.59 J2.1
  Top 0.305: J2.1 31.25,45.75 v31.2,45.8
  Bottom 0.203: v56.68,26.7 56.49,26.89 47.08,26.89 46.19,27.78 38.67,27.78 v38.62,27.74
  Bottom 0.305: v31.2,45.8 31.2,46.65 P8.P$1
GP1/UART0_RX  (via drill 0.25, 0.3)
  Top 0.2: R83.2 36.04,38.76 37.19,37.61 37.19,29.86 38.4,28.65 v38.4,28.57
  Top 0.203: U1.3 58.31,27.15 v58.07,27.39
  Top 0.254: R83.2 33.2,38.9 33.31,39.01 33.41,39.01 33.74,39.34 J2.2
  Top 0.305: J2.2 33.74,45.66 v33.7,45.7
  Bottom 0.203: v58.07,27.39 47.22,27.39 46.31,28.3 38.67,28.3 v38.4,28.57
  Bottom 0.305: v33.7,45.7 33.7,46.61 P17.P$1
GP2/I2C1_SDA  (via drill 0.25, 0.3)
  Top 0.2: 37.69,41.11 36.25,42.54 36.25,43.42
  Top 0.203: U1.4 58.71,27.25 v58.84,27.38 | v38.5,29.39 38.32,29.39 37.69,30.03 37.69,41.11
  Top 0.254: J2.3 36.28,43.45 36.25,43.42
  Top 0.305: J2.3 36.28,45.88 v36.3,45.9
  Bottom 0.203: v58.84,27.38 58.26,27.96 47.32,27.96 46.34,28.93 38.95,28.93 v38.5,29.39
  Bottom 0.305: v36.3,45.9 36.3,46.65 P18.P$1
GP3/I2C1_SCL  (via drill 0.25, 0.3)
  Top 0.203: U1.5 59.11,25.88 v58.71,25.48 | v44,30.22 43.98,30.21 43.98,26.8 v44.03,26.75 | v38.38,30.23 38.14,30.47 38.14,41.76 38.82,42.44 J2.4
  Top 0.305: J2.4 38.82,45.72 v38.9,45.8
  Bottom 0.203: v58.71,25.48 57.04,25.48 56.07,26.45 46.84,26.45 46.56,26.73 44.04,26.73 v44.03,26.75 | v44,30.22 43.95,30.27 38.41,30.27 v38.38,30.23
  Bottom 0.305: v38.9,45.8 38.9,46.69 P19.P$1
GP4/UART1_TX  (via drill 0.25, 0.3)
  Top 0.2: J1.2 19.85,10.34 20.74,11.23 29.26,11.23 34.53,16.5 v38.66,16.5 | J2.5 41.36,42.48 38.92,40.04
  Top 0.203: 41.11,42.31 41.03,42.23 41.03,42.15 38.92,40.04 38.92,29.94 v39.33,29.53 | U1.6 59.51,25.4 59.03,24.92 v58.15,24.92 57.73,24.92 57.02,24.21 57.02,21.89 55.91,20.78 55.91,18.26 v55.58,17.94 | v44.75,29.55 44.73,29.52 v44.73,25.98
  Top 0.305: J1.2 19.88,9.42 v19.88,7.42 | J2.5 41.36,45.66 v41.5,45.8
  Bottom 0.2: v38.66,16.5 40.08,16.5 41.49,15.09 54.66,15.09
  Bottom 0.203: v55.58,17.94 55.58,16.01 54.66,15.09 | v58.15,24.92 56.91,24.92 55.84,25.99 44.78,25.99 44.79,25.98 | 44.81,25.95 44.79,25.98 | v44.73,25.98 44.79,25.98 | v39.33,29.53 39.42,29.44 44.64,29.44 v44.75,29.55
  Bottom 0.305: P23.P$1 19.9,7.4 v19.88,7.42 | v41.5,45.8 41.5,46.7 P20.P$1
GP5/UART1_RX  (via drill 0.25, 0.3)
  Top 0.2: v44.97,43.32 44.4,43.32 44.33,43.24 | J1.1 21.85,10.3 22.27,10.72 29.44,10.72 34.58,15.86 v38.13,15.86
  Top 0.203: v56.25,17.68 56.34,17.77 56.34,20.54 57.49,21.68 57.49,23.94 57.88,24.33 59.35,24.33 59.91,24.89 U1.7 59.91,25 v59.94,24.97 | 44.33,43.24 43.95,43.62 J2.6 44,43.63 44.31,43.32 v44.97,43.32
  Top 0.305: v21.8,7.4 21.8,9.4 J1.1 | J2.6 43.9,45.8 v44,45.9
  Bottom 0.2: 67.91,33.62 67.91,33.72 67.91,37.84 62.43,43.32 v44.97,43.32 | v38.13,15.86 40.05,15.86 41.3,14.61 54.87,14.61 56.25,15.99 v56.25,17.68 | 66.56,26.43 66.16,26.03 63.41,26.03 63.28,26.16 61.99,26.16 61.84,26.02
  Bottom 0.203: 67.91,33.72 67.91,27.78 66.56,26.43 | v59.94,24.97 59.97,24.94 60.77,24.94 61.84,26.02
  Bottom 0.305: P24.P$1 v21.8,7.4 | v44,45.9 44,46.66 P50.P$1
GP6*I2C1_SDA  (via drill 0.25, 0.3)
  Top 0.2: v47.4,42.72 46.71,42.72 46.37,43.05 | 46.78,43.05 46.37,43.05 | 46.37,43.05 46.07,43.05 46.07,43.6
  Top 0.203: U1.8 60.31,25.76 v60.52,25.55 | J2.7 46.44,42.98 46.7,42.72 v47.4,42.72
  Top 0.254: J2.7 46.78,43.29 46.78,43.05
  Top 0.305: J2.7 46.44,45.84 v46.5,45.9
  Bottom 0.2: 67.47,33.11 67.47,33.27 67.47,37.64 62.38,42.73 47.41,42.73 v47.4,42.72 | 66.34,26.88 65.9,26.44 63.69,26.44 63.55,26.58 61.55,26.58 v60.52,25.55
  Bottom 0.203: 66.34,26.88 67.47,28 67.47,33.27
  Bottom 0.305: v46.5,45.9 46.5,46.7 P51.P$1
GP7*I2C1_SCL  (via drill 0.25, 0.3)
  Top 0.203: U1.9 60.71,27.19 v60.54,27.36 | J2.8 48.98,42.04 v50.02,42.04
  Top 0.305: J2.8 48.98,45.88 v49,45.9
  Bottom 0.2: 67,32.27 67,32.35 67,37.45 62.34,42.11 50.09,42.11 v50.02,42.04 | 66.14,27.36 65.64,26.86 63.91,26.86 63.76,27.01 60.89,27.01 v60.54,27.36
  Bottom 0.203: 67,32.35 67,28.23 66.14,27.36
  Bottom 0.305: v49,45.9 49,46.7 P52.P$1
GP8/LCD_DC  (via drill 0.25)
  Top 0.203: U1.11 61.51,24.86 v61.31,24.66 | J17.11 47.91,22.26 v47.63,22.53 v47.63,22.54
  Bottom 0.2: P34.P$1 47.52,24.17
  Bottom 0.203: v61.31,24.66 61.31,24.64 61.02,24.35 48.73,24.35 48.05,23.67 | 48.05,23.67 47.63,23.25 v47.63,22.54 | P34.P$1 48.05,23.68 48.05,23.67
GP9/LCD_CS/SPI_CS0  (via drill 0.25)
  Top 0.203: U1.12 61.91,24.24 v61.9,24.22 | v47.63,21.16 47.72,21.25 J17.9
  Bottom 0.203: v61.9,24.22 61.76,24.22 61.4,23.87 48.97,23.87 48.2,23.1 48.2,22.17 47.9,21.87 | v47.63,21.16 47.63,21.6 47.9,21.87 | P35.P$1 48.33,21.44 47.9,21.87
GP10/SPI_CLK/LCD_CLK/TP_CLK/SD_CLK  (via drill 0.25, 0.3)
  Top 0.2: U3.16 27.03,20.36 27.25,20.14 v27.25,19.42 | v30.71,19.21 30.82,19.21 32.44,17.59 v32.44,17.33 | v43.58,21.75 45.32,21.75 J17.10 | v61.98,11.03 61.98,15.03 SD1.5
  Top 0.203: 63.45,17.94 v63.45,17.92 | U1.13 62.31,25.24 v62.55,25 | v44.91,21.75 45.32,21.75 | v53.68,15.76 53.8,15.64 v53.8,10.3 v53.79,10.29
  Top 0.305: 63.9,18.84 R25.1 64.1,18.59 63.45,17.94 | 61.86,15.15 SD1.5 61.91,16.39 v63.45,17.92
  Bottom 0.2: v27.25,19.42 27.38,19.28 30.64,19.28 v30.71,19.21 | v32.44,17.33 32.63,17.52 32.63,20.15 33.04,20.56 40.88,20.56 42.08,21.76 | v43.58,21.75 v43.57,21.76 42.02,21.76 P32.P$1 | 45.02,17.18 45.86,16.34 | v53.79,10.29 61.24,10.29 v61.98,11.03 | v63.45,17.92 63.45,17.93 63.94,18.43 P45.P$1
  Bottom 0.203: P45.P$1 64.08,18.63 | v63.45,17.92 63.51,17.92 64.36,18.77 64.36,24.67 64.03,25 v62.55,25 | v44.91,21.75 44.91,17.29 45.02,17.18 | 45.86,16.34 53.23,16.34 53.74,15.83 53.74,15.82 v53.68,15.76
  Bottom 0.254: 42.08,21.76 42.08,22.34 P32.P$1
GP11/SPI_MOSI/LCD_SDI/TP_SDI/SD_SDI  (via drill 0.25, 0.3)
  Top 0.2: J17.13 48.9,23.22 v44.23,23.22 | v36.65,26.39 35.87,26.39 R24.1 34.93,27.33 v32.02,27.33 v32.02,27.32 | U3.14 27.21,21.63 v27.29,21.55
  Top 0.203: R39.2 67.1,18.31 v66.78,17.99 | U1.14 62.71,25.87 v62.96,25.62 | v52.95,15.74 52.95,15.64 53.23,15.36 53.23,9.96 53.27,9.92 v53.27,9.73 | SD1.3 64.13,15.08 v64.13,13.78
  Top 0.305: SD1.3 64.11,16.16 65.33,17.38 66.22,17.38 67.1,18.26 R39.2
  Bottom 0.2: 40.36,25.7 39.67,26.39 v36.65,26.39 | v32.02,27.32 31.72,27.32 28.78,24.38 28.78,22.31 28.02,21.55 v27.29,21.55 26.49,21.55 P44.P$1 | 64.05,10.76 63.01,9.72 v53.28,9.72 v53.27,9.73 | 44.29,21.64 44.29,17.16 45.6,15.85
  Bottom 0.203: 44.29,17.16 44.29,23.16 v44.23,23.22 42.84,23.22 40.36,25.7 | v52.95,15.74 52.84,15.85 45.6,15.85 | v64.13,13.78 64.13,10.84 64.05,10.76
  Bottom 0.254: v62.96,25.62 65.98,25.62 66.82,24.78 66.82,22.27 | 66.82,22.27 66.82,18.03 v66.78,17.99 | P36.P$1 66.76,22.21 66.82,22.27
GP12/SPI_MISO/LCD_SDO/TP_SDO/SD_SDO  (via drill 0.25, 0.3, 0.35)
  Top 0.2: v37.1,17.19 33.59,17.19 30.94,19.84 30.45,19.84 v30.25,20.05 | U3.12 27.93,22.9 28.39,22.44 28.39,20.58 v27.82,20
  Top 0.203: U1.15 63.65,27.22 v63.65,24.44 | SD1.7 59.71,13.86 v59.67,13.82
  Top 0.305: SD1.7 59.71,15.68 61.82,17.79 v62.11,17.79 62.8,18.48 R40.2
  Bottom 0.2: 58.58,13.55 57.11,12.09 56.97,11.95 39.16,11.95 37.11,14 v37.11,17.18 v37.1,17.19 | v30.25,20.05 30.2,20 v27.82,20
  Bottom 0.203: P46.P$1 57.6,11.6 57.11,12.09 | v63.65,24.44 63.88,24.21 63.88,19.56 v62.11,17.79 | v59.67,13.82 58.84,13.82 58.58,13.55
GP14/BUZZER  (via drill 0.25)
  Top 0.203: U1.17 70.14,28.12 71.01,27.25 71.01,22.55 71.68,21.88 74.78,21.88 v74.83,21.93 | 76.33,13.93 R14.2 75.4,14.86 v74.8,14.86
  Top 0.508: Q2.1 76.36,12.36 R14.2
  Bottom 0.203: v74.8,14.86 74.8,21.9 v74.83,21.93
GP15/LCD_RST  (via drill 0.25, 0.3)
  Top 0.203: U1.18 70.63,28.52 v70.96,28.19 | v54.4,9.12 54.4,15.9 v54.42,15.92 | J17.15 45.7,24.25 v45.51,24.06
  Bottom 0.2: P5.P$1 49.14,16.77 49.15,16.76
  Bottom 0.203: v70.96,28.19 73.2,25.95 73.21,25.95 73.21,12.82 69.56,9.17 54.45,9.17 v54.4,9.12 | v54.42,15.92 v54.42,15.93 53.58,16.76 49.15,16.76 46.08,16.76 45.5,17.34 45.5,20.53 45.5,24.05 v45.51,24.06
GP16/TP_CS/SPI_CS1  (via drill 0.25, 0.3)
  Top 0.203: v27.73,22.23 27.97,21.99 27.97,21.29 27.64,20.95 25.94,20.95 U3.15 | U1.27 64.18,32.12 64.33,32.27 v64.33,33.34
  Bottom 0.203: v27.73,22.23 v27.74,22.23 28.26,22.75 28.26,24.53 37.23,33.49 64.17,33.49 v64.33,33.34
GP17/TP_IRQ  (via drill 0.25, 0.3)
  Top 0.2: U3.11 v27.59,23.54 v27.6,23.53
  Top 0.203: U1.28 63.53,32.54 v63.53,34.04 63.55,34.02 67.5,34.02 R105.1
  Bottom 0.2: v27.6,23.53 27.6,24.53 37.11,34.04 60.85,34.04
  Bottom 0.203: 60.85,34.04 v63.53,34.04
GP18/LCD_BL_PWM  (via drill 0.25, 0.3)
  Top 0.203: v33.79,31.94 34.38,31.35 Q1.1 | v62.95,34.58 62.71,34.34 U1.29
  Top 0.406: Q1.1 34.38,29.64 R8.2
  Bottom 0.203: v33.79,31.94 34.29,31.94 36.88,34.53 62.9,34.53 v62.95,34.58
GP19*  (via drill 0.25, 0.3)
  Top 0.203: v51.92,40.2 51.92,43.62 | U1.30 62.31,34.79 63.07,35.55 63.07,39.55 v63.41,39.89
  Top 0.254: J2.9 51.53,43.62 | 51.53,43.62 51.92,43.62 | J2.9 51.53,43.62 | 51.53,43.62 51.92,43.62 | J2.9 51.53,43.62 | 51.53,43.62 51.92,43.62
  Top 0.305: J2.9 51.52,45.72 v51.6,45.8
  Bottom 0.203: v63.41,39.89 63.07,40.23 51.95,40.23 v51.92,40.2
  Bottom 0.305: v51.6,45.8 51.6,46.65 P53.P$1
GP20/I2C0_SDA  (via drill 0.25, 0.3)
  Top 0.2: v62.77,40.77 65.83,40.77 v65.98,40.63
  Top 0.203: U1.31 61.91,34.99 62.64,35.72 62.64,40.64 v62.77,40.77
  Top 0.254: J2.10 54.34,43.35
  Top 0.3: J6.2 41.85,7.55 v41.9,7.5
  Top 0.305: J6.2 41.85,10.5 42.81,11.47 48.83,11.47 R3.1 | J2.10 54.06,45.76 v54.1,45.8
  Bottom 0.2: v41.9,7.5 41.9,7.87 42.59,8.56 69.64,8.56 73.72,12.64 73.72,32.8 65.98,40.54 v65.98,40.63
  Bottom 0.254: v65.98,40.63 62.71,43.9 55.89,43.9 54.1,45.69 v54.1,45.8
  Bottom 0.3: v41.9,7.5 P15.P$1
  Bottom 0.305: v54.1,45.8 54.1,46.69 P54.P$1
GP21/I2C0_SCL  (via drill 0.25, 0.3)
  Top 0.2: v66.78,40.62 66.78,40.69 66.04,41.43 62.33,41.43 v62.21,41.31
  Top 0.203: U1.32 61.51,35.24 62.2,35.93 v62.2,41.3 v62.21,41.31
  Top 0.3: J6.1 43.85,7.55 v43.9,7.5
  Top 0.305: J6.1 43.85,10.4 44.22,10.77 49.7,10.77 52.1,13.17 R26.1 | v57.58,44.96 v57.57,44.96 56.7,44.96 56.6,44.86 J2.11 56.9,43.33
  Bottom 0.203: v66.78,40.62 66.78,40.49 74.19,33.08 74.19,12.39 69.85,8.05 44.26,8.05 43.9,7.69 v43.9,7.5 | 62.18,41.28 v62.21,41.31
  Bottom 0.254: v57.58,44.96 57.96,44.57 62.79,44.57 66.74,40.62 v66.78,40.62
  Bottom 0.3: v43.9,7.5 P16.P$1
  Bottom 0.305: v57.58,44.96 57.58,45.87 P55.P$1
GP22/SD_CS/SPI_CS2  (via drill 0.25)
  Top 0.2: v63.92,35.24 64.55,34.61 68.47,34.61 v68.52,34.66 | v60.55,35.17 60.71,35.01 U1.34
  Top 0.305: SD1.2 65.21,16.29 65.58,16.67 66.54,16.67 68.23,18.35 68.23,18.87 R36.2 68.4,18.48 v67.93,18.01
  Bottom 0.2: v67.93,18.01 68.41,18.49 68.41,20.56 68.42,20.56 | 68.42,20.56 68.42,34.56 v68.52,34.66 | v63.92,35.24 60.62,35.24 v60.55,35.17 | P47.P$1 69.06,20.56 68.42,20.56
GP26*ADC0*I2C1_SDA  (via drill 0.3)
  Top 0.203: U1.38 59.11,42.44 59.4,42.73
  Top 0.254: J2.12 59.4,43.37 59.4,42.73
  Top 0.305: J2.12 59.14,44.74 59.58,45.18 v60.11,45.18
  Bottom 0.305: v60.11,45.18 60.11,45.88 P56.P$1
GP27*ADC1*I2C1_SCL  (via drill 0.25, 0.3)
  Top 0.203: v61.62,45.79 61.61,45.78 61.39,46 56,46 55.57,45.57 55.57,39.74 55.58,39.74 55.58,39.16 v55.68,39.06 | U1.39 58.71,39.05 v58.46,39.3
  Top 0.254: J2.13 61.61,43.69 61.61,45.78
  Top 0.305: J2.13 61.68,45.79 v61.62,45.79
  Bottom 0.203: v58.46,39.3 58.16,39 55.74,39 v55.68,39.06
  Bottom 0.305: P57.P$1 61.62,46.63 v61.62,45.79
GP28*ADC2  (via drill 0.25, 0.3)
  Top 0.203: 64.41,43.68 64.33,43.76 64.33,45.72 v64.29,45.72 64.29,45.03 | 64.05,45.02 64.16,44.9 64.25,44.99 64.25,45.75 63.47,46.53 55.82,46.53 55.07,45.78 v55.07,39.53 | U1.40 58.31,38.67 57.79,39.19 v57.79,39.59
  Top 0.254: J2.14 64.22,44.84 64.05,45.02
  Top 0.305: J2.14 64.22,45.72 v64.29,45.72
  Bottom 0.203: v57.79,39.59 57.79,39.62 57.77,39.64 55.18,39.64 v55.07,39.53
  Bottom 0.305: v64.29,45.72 64.26,45.72 P58.P$1
GP29/BAT+_ADC3  (via drill 0.25, 0.3)
  Top 0.203: R20.2 53.36,36.3 53.29,36.24 | 53.16,36.1 53.29,36.24 | U1.41 57.91,34.18 57.69,34.4 57.69,35.65 v57.72,35.68 | v54.06,35.74 53.83,35.74 53.33,36.24 53.29,36.24
  Top 0.305: R19.1 53.16,36.1
  Bottom 0.203: v57.72,35.68 57.66,35.74 v54.06,35.74
IM0  (via drill 0.35)
  Top 0.203: J17.38 46.34,35.75 44.69,34.1 R15.1
  Top 0.254: R16.2 42.31,32.75 v43.27,32.75
  Top 0.305: R15.1 R16.2
  Bottom 0.254: P60.P$1 43.32,32.69 v43.27,32.75
IM1  (via drill 0.35)
  Top 0.203: J17.39 43.41,36.25 42.96,36.7 R17.1
  Top 0.254: R18.2 v43.29,35.4 | v43.29,35.4
  Top 0.305: R18.2 R17.1
  Bottom 0.254: v43.29,35.4 P61.P$1
IM2  (via drill 0.35)
  Top 0.203: J17.40 43.57,36.75 42.32,38 R22.2
  Top 0.254: R21.1 43.17,39.3 v43.21,39.34 | v43.21,39.34 | v43.21,39.34 v43.22,39.33
  Top 0.305: R21.1 R22.2
  Bottom 0.254: v43.22,39.33 43.24,39.36 P62.P$1
LED-K  (via drill 0.3)
  Top 0.305: J17.34 46.78,33.75 46.7,33.83 | J17.35 46.7,34.25 | J17.36 46.72,34.75 46.7,34.73
  Top 0.406: 35.91,34.74 R9.2 35.86,36.25 v35.85,36.26 | v46.7,35.13 46.7,34.73 46.7,34.25 | 46.7,34.25 46.7,33.83 | 46.7,34.25 46.7,34.35
  Bottom 0.305: P41.P$1 35.2,36.26 v35.85,36.26
  Bottom 0.406: v35.85,36.26 45.82,36.26 46.7,35.38 v46.7,35.13
LED_A  (via drill 0.35)
  Top 0.254: J17.33 47.59,33.25 47.59,33.26 47.17,33.26 | 47.17,33.26 46.63,33.26 44.67,31.3 R27.1 | 47.17,33.26 47.19,33.23 v47.19,32.58
  Bottom 0.254: P63.P$1 v47.19,32.58
N$1
  Top 0.203: 73.23,28.29 X1.3 73.23,28.32 R2.1 C2.2
N$2
  Top 0.203: 73.24,29.94 73.26,29.94 | 73.26,29.94 R2.2 | U1.21 73.04,29.72 73.26,29.94
N$3
  Top 0.203: U1.20 71.48,29.32 72.18,28.62 72.18,27.3 72.49,26.99 74.08,26.99 74.93,26.14 X1.1 74.84,25.86 C1.1
N$4
  Top 0.508: R4.1 81.3,13.8 81.3,12.75 82.1,11.95 B1.1 81.85,11.95 78.8,8.9 D1.-
N$5
  Top 0.203: 16.58,42.82 R68.1
  Top 0.305: J15.B5 16.58,42.82
N$6
  Top 0.508: 78.18,11.73 B1.2 | B1.2 78.3,11.95 | B1.2 78.4,10.9 77.85,10.35 Q2.3 75.05,10.35 74.8,10.1 D1.+
N$7
  Top 0.406: Q1.3 34.9,33.26 34.9,34.2 34.4,34.7 R9.1
N$9
  Top 0.203: 14.96,36.13 U5.5
  Top 0.305: R84.1 14.96,35.48 14.96,36.13
N$10
  Top 0.813: U6.3 19.05,17.27 18.88,17.44 L4.1
N$14
  Top 0.254: J14.A5 9.54,17.93 12,15.46 R13.2
N$15
  Top 0.305: R85.1 D15.+
N$16
  Top 0.254: R69.2 19.94,42.9 19.94,44.45 19.58,44.81 J15.A5
N$19
  Top 0.254: J14.B5 10.73,14.93 11.93,13.73 R12.1
N$20
  Top 0.254: U3.7 33.17,24.17 33.8,24.8 34.04,24.8 R23.2
N$22
  Top 0.305: SD1.1 66.31,15.28 69.7,18.67 R37.2
N$24
  Top 0.305: SD1.8 58.61,16.13 59.53,17.05 60.13,17.05 61.5,18.42 R38.2
N$28
  Top 0.254: U7.9 32.4,35 32.6,35.2 32.6,36.1 31.46,37.24 R70.1
N$31
  Top 0.254: U7.8 32.9,34.5 33.2,34.8 R83.1
N$35
  Top 0.254: R35.1 D3.+
N$43
  Top 0.305: R82.2 20.77,13.59 R81.2 19.71,12.53 17.61,12.53 U6.5
QSPI_CS  (via drill 0.3)
  Top 0.2: U1.56 56.24,27.32 56.08,27.16 56.08,22.57 v56.38,22.27 | v52.4,21.76 51.69,21.76 51.64,21.81
  Top 0.203: R7.1 51.81,26.02 | U1.56 56.81,27.32
  Top 0.305: R7.1 R6.1 51.64,21.81 51.56,21.73 U2.1
  Bottom 0.2: v56.38,22.27 52.91,22.27 v52.4,21.76
QSPI_D0  (via drill 0.25)
  Top 0.2: U1.53 55.63,28.52 54.8,27.69 54.8,18.47 v54.76,18.43 | U2.5 v58.24,17.93 v58.23,17.92
  Top 0.203: U2.5
  Bottom 0.2: v58.23,17.92 57.56,18.6 54.93,18.6 v54.76,18.43
QSPI_D1  (via drill 0.3)
  Top 0.2: U1.55 56.02,27.72 55.66,27.36 55.66,21.78 v55.88,21.56 | v52.37,20.47 U2.2
  Bottom 0.2: v55.88,21.56 53.46,21.56 v52.37,20.47
QSPI_D2  (via drill 0.25, 0.3)
  Top 0.2: U1.54 55.83,28.12 55.22,27.51 55.22,19.95 v55.36,19.81 | v52.38,19.21 51.48,19.21 51.46,19.2
  Top 0.203: 51.76,19.2 51.46,19.2 U2.3
  Bottom 0.2: v55.36,19.81 v55.35,19.8 52.93,19.8 52.38,19.25 v52.38,19.21
QSPI_D3  (via drill 0.25, 0.3)
  Top 0.2: U1.51 55.21,29.32 53.94,28.05 53.94,20.66 v53.77,20.48 | 58.4,20.46 v58.22,20.28
  Top 0.203: 59.34,20.48 U2.7 58.4,20.46
  Bottom 0.2: v58.22,20.28 58.02,20.48 v53.77,20.48
QSPI_SCK  (via drill 0.25, 0.3)
  Top 0.2: U1.52 55.41,28.92 54.37,27.88 54.37,19.35 v54.12,19.1
  Top 0.203: 59.3,19.14 U2.6 59.32,19.16 v58.21,19.16
  Bottom 0.2: v58.21,19.16 | v58.21,19.16 54.19,19.16 v54.12,19.1
RESET  (via drill 0.25)
  Top 0.203: U1.26 64.4,31.72 64.81,32.13 64.81,32.67 65.15,33.01 71.03,33.01 71.74,32.29 74.05,32.29 C4.1
  Top 0.305: 77.6,37.45 SW1.2 v76.8,37.7
  Top 0.508: C4.1 R1.1 77.07,34.36 77.6,34.89 SW1.2
  Bottom 0.305: P31.P$1 75.96,37.72 75.97,37.71 | 75.97,37.71 75.97,37.79 | v76.8,37.7 75.98,37.7 75.97,37.71
SWCLK  (via drill 0.25)
  Top 0.203: U1.24 65.04,30.92 v65.41,31.29
  Bottom 0.2: v65.41,31.29 65.32,31.2 65.32,30.12 P11.P$1
SWDIO  (via drill 0.25)
  Top 0.203: U1.25 64.62,31.32 65.4,32.1 v65.4,32.41
  Bottom 0.2: v65.4,32.41 65.32,32.33 P12.P$1
TP_X+  (via drill 0.3)
  Top 0.254: J17.1 39.99,17.25 37.4,19.84 v37.4,19.9 | U3.2 32.54,21 33.38,20.16 v33.38,19.91 v33.39,19.9 C30.2
  Bottom 0.2: P33.P$1 34.49,19.92 34.5,19.93
  Bottom 0.254: v37.4,19.9 37.37,19.93 34.5,19.93 33.4,19.93 v33.38,19.91
TP_X-  (via drill 0.3)
  Top 0.254: J17.3 40.65,18.25 38.7,20.2 38.7,22.14 v38.76,22.2 | U3.4 33.23,22.27 v33.3,22.19 34.03,22.19 C39.2
  Bottom 0.254: v33.3,22.19 v33.31,22.2 v38.76,22.2 38.76,23.46 P38.P$1
TP_Y+  (via drill 0.3)
  Top 0.254: J17.4 40.95,18.75 39.4,20.3 v39.4,21.2 | U3.3 32.76,21.64 33.15,21.24 v33.35,21.24 33.39,21.2 C38.2
  Top 0.508: C38.2 34.28,21.14
  Bottom 0.2: v39.4,21.2 39.4,21.22 39.95,21.77 P39.P$1
  Bottom 0.254: v39.4,21.2 39.36,21.24 v33.36,21.24 v33.35,21.24
TP_Y-  (via drill 0.3)
  Top 0.254: J17.2 40.36,17.75 38.1,20.01 v38.1,22.9 | U3.5 33.1,22.9 v33.3,23.1 33.3,23.5 33.6,23.8 C40.2
  Bottom 0.2: 34.46,22.96 34.4,22.9
  Bottom 0.25: P37.P$1 34.46,22.96
  Bottom 0.254: v38.1,22.9 34.4,22.9 33.5,22.9 v33.3,23.1
UART_USB_D+  (via drill 0.3)
  Top 0.254: U7.1 25.8,35.5 25.6,35.7 25.6,40.8 24.7,41.7 19,41.7 18.58,42.12 18.58,42.9 | 18.58,42.9 J15.A6 18.58,47.02 18.4,47.2 17.8,47.2 17.58,46.98 J15.B6 | v18.86,42.9 18.58,42.9
  Bottom 0.254: P27.P$1 v18.86,42.9
UART_USB_D-  (via drill 0.3)
  Top 0.254: J15.A7 18.08,44.2 | 18.08,44.2 18.08,42.9 | 18.08,42.9 18.08,41.92 18.8,41.2 24.49,41.2 25.1,40.59 25.1,35.4 25.5,35 U7.2 | J15.B7 19.08,44.32 v19.2,44.2 | v17.5,44.2 18.08,44.2 | v17.92,42.9 18.08,42.9
  Bottom 0.254: v19.2,44.2 v17.5,44.2 | v17.92,42.9 P28.P$1
USB_D+  (via drill 0.25, 0.3)
  Top 0.203: U1.47 55.16,30.92 54.99,30.75 v54.53,30.75
  Top 0.254: J14.A6 6.91,16.93 6.68,16.69 6.68,16.16 6.91,15.93 J14.B6 9.67,15.93 v9.84,15.77
  Bottom 0.203: v9.84,15.77 9.86,15.77 10.27,15.77 10.75,15.29 15.01,15.29 16.15,14.15 27.46,14.15 31.77,18.46 31.77,24.82 37.87,30.92 53.79,30.92 53.96,30.75 v54.53,30.75
  Bottom 0.254: P3.P$1 9.83,15.74 9.86,15.77
USB_D-  (via drill 0.25, 0.3)
  Top 0.203: U1.46 55.17,31.32 54.98,31.51 v54.51,31.51
  Top 0.254: J14.A7 9.44,16.43 | 9.44,16.43 10.1,16.43 v10.12,16.45 | J14.B7 9.18,17.43 9.46,17.16 9.46,16.45 9.44,16.43
  Bottom 0.203: v10.12,16.45 10.87,15.7 15.18,15.7 16.3,14.58 18.7,14.58 27.28,14.58 31.31,18.61 31.31,24.99 37.67,31.35 53.81,31.35 53.97,31.51 v54.51,31.51
  Bottom 0.254: P4.P$1 10.13,16.47 v10.12,16.45
VBAT_IN  (via drill 0.3)
  Top 0.508: U5.4 12.83,36.1 C23.1 12.8,34.27 C22.2 10.78,30.58 10.78,29.43 10.8,29.4 D4.2 10.36,30.91 v9.87,30.42 | R66.2 6.69,24.91 Q19.1 6.69,26.35 7.75,27.4 8.55,27.4 v8.99,27.84
  Top 0.61: D6.2 10.78,29.43
  Bottom 0.508: v9.87,30.42 9.87,30.38 8.99,29.5 v8.99,27.84
VIN  (via drill 0.55)
  Top 0.508: D2.- 9.29,26.67 | Q19.2 8.74,26.32 8.82,26.32 9.22,26.72 9.22,26.69 9.29,26.69 9.29,26.67 | C31.2 13.93,18.6 C32.1 13.99,20.09 D5.2 13.81,20.27 13.81,20.84 | 9.29,26.67 v9.29,21.95 | 13.81,20.84 13.96,20.99 v14.87,20.99 | D8.2 13.81,21.6 13.81,20.84
  Top 0.61: U6.1 18.14,13.49 16.65,14.98 U6.4 15.49,15.39 C31.2
  Bottom 0.508: v14.87,20.99 v14.87,20.98 13.89,21.96 v9.3,21.96 v9.29,21.95
(copper drawn outside any net)
  shapes: Top area x2

## Text on the board
tPlace: TX0_GP0 | RX0_GP1 | GP | 2 | 4 | 5 | 6 | 7 | 19 | 20 | 26 | GND | 3.3V | 0 | 1 | 3 | 21 | 27 | 28 | + | - | D4 | D6 | V1.0 | D8 | D5 | Pico Display-2.8 Inch | SKU:DIS01028P | GND | 3.3V | TX1_GP4 | RX1_GP5 | GND | 3.3V | SDA_GP20 | SCL_GP21
bPlace: GND | GND | +5V_2 | 3.3V | D-_2 | D+_2 | BAT+ | GND | 3.3V | +5V_1 | D-_1 | D+_1 | GND | GND | GND | 3.3V | GND | 3.3V